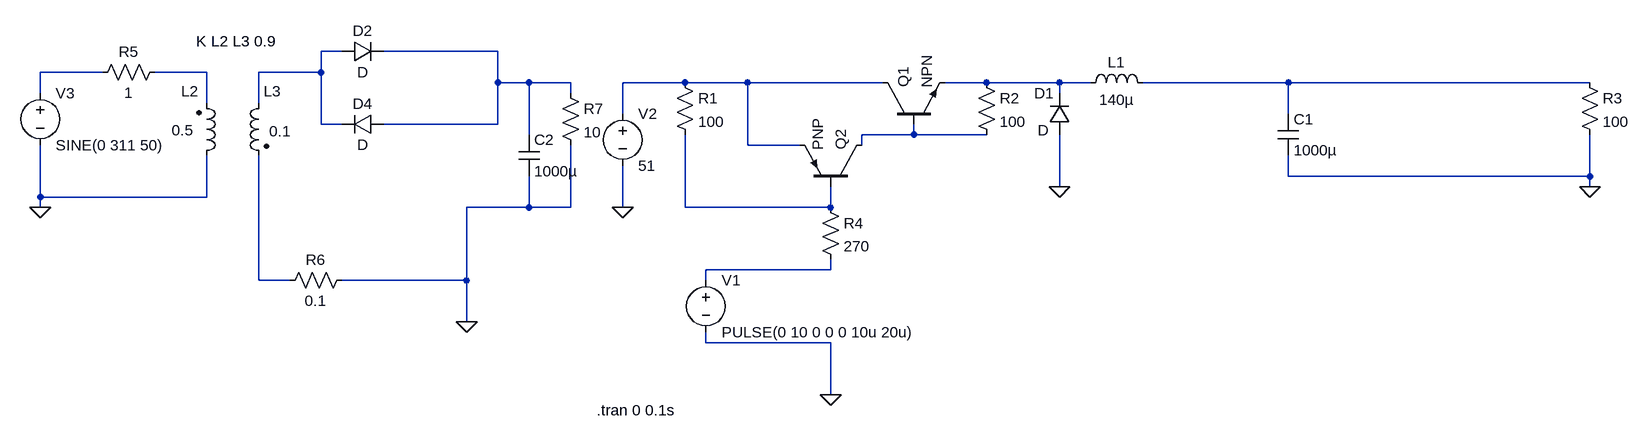
[diagram p0: schematic Fuente conmutada - prototipo 1.asc]
Fuente conmutada - prototipo 1.asc, the LTspice schematic file:
Version 4
SHEET 1 1476 880
WIRE -512 48 -544 48
WIRE -272 48 -448 48
WIRE -880 80 -976 80
WIRE -720 80 -800 80
WIRE -544 80 -544 48
WIRE -544 80 -640 80
WIRE -272 96 -272 48
WIRE -224 96 -272 96
WIRE -160 96 -224 96
WIRE 16 96 -80 96
WIRE 112 96 16 96
WIRE 320 96 112 96
WIRE 480 96 416 96
WIRE 592 96 480 96
WIRE 640 96 592 96
WIRE 944 96 720 96
WIRE 1408 96 944 96
WIRE -976 112 -976 80
WIRE -160 112 -160 96
WIRE 592 112 592 96
WIRE -720 128 -720 80
WIRE -640 128 -640 80
WIRE -80 144 -80 96
WIRE 944 144 944 96
WIRE -544 160 -544 80
WIRE -512 160 -544 160
WIRE -272 160 -272 96
WIRE -272 160 -448 160
WIRE -224 176 -224 96
WIRE 368 176 368 160
WIRE 368 176 288 176
WIRE 480 176 368 176
WIRE 112 192 112 96
WIRE 192 192 112 192
WIRE 288 192 288 176
WIRE 944 240 944 208
WIRE 1408 240 1408 176
WIRE 1408 240 944 240
WIRE 592 256 592 176
WIRE 1408 256 1408 240
WIRE -976 272 -976 192
WIRE -720 272 -720 208
WIRE -720 272 -976 272
WIRE -976 288 -976 272
WIRE -224 288 -224 240
WIRE -224 288 -320 288
WIRE -160 288 -160 192
WIRE -160 288 -224 288
WIRE -80 288 -80 224
WIRE 16 288 16 176
WIRE 240 288 240 256
WIRE 240 288 16 288
WIRE 240 384 240 368
WIRE 240 384 48 384
WIRE -640 400 -640 208
WIRE -592 400 -640 400
WIRE -320 400 -320 288
WIRE -320 400 -512 400
WIRE 48 400 48 384
WIRE -320 464 -320 400
WIRE 48 496 48 480
WIRE 240 496 48 496
WIRE 240 576 240 496
FLAG 240 576 0
FLAG 592 256 0
FLAG 1408 256 0
FLAG -976 288 0
FLAG -320 464 0
FLAG -80 288 0
SYMBOL res 0 80 R0
SYMATTR InstName R1
SYMATTR Value 100
SYMBOL npn 320 160 R270
SYMATTR InstName Q1
SYMBOL pnp 288 256 M270
SYMATTR InstName Q2
SYMBOL res 464 80 R0
SYMATTR InstName R2
SYMATTR Value 100
SYMBOL diode 608 176 R180
WINDOW 0 24 64 Left 2
WINDOW 3 32 7 Left 2
SYMATTR InstName D1
SYMBOL ind 624 112 R270
WINDOW 0 32 56 VTop 2
WINDOW 3 5 56 VBottom 2
SYMATTR InstName L1
SYMATTR Value 140µ
SYMBOL res 1392 80 R0
SYMATTR InstName R3
SYMATTR Value 100
SYMBOL voltage 48 384 R0
WINDOW 123 0 0 Left 2
WINDOW 39 0 0 Left 2
SYMATTR InstName V1
SYMATTR Value PULSE(0 10 0 0 0 10u 20u)
SYMBOL res 224 272 R0
SYMATTR InstName R4
SYMATTR Value 270
SYMBOL voltage -976 96 R0
WINDOW 123 0 0 Left 2
WINDOW 39 0 0 Left 2
SYMATTR InstName V3
SYMATTR Value SINE(0 311 50)
SYMBOL ind2 -736 224 M180
WINDOW 0 -23 115 Left 2
WINDOW 3 -38 55 Left 2
SYMATTR InstName L2
SYMATTR Value 0.5
SYMBOL ind2 -624 112 M0
WINDOW 0 -19 -3 Left 2
WINDOW 3 -34 59 Left 2
SYMATTR InstName L3
SYMATTR Value 0.1
SYMBOL diode -512 64 R270
WINDOW 0 32 32 VTop 2
WINDOW 3 0 32 VBottom 2
SYMATTR InstName D2
SYMBOL diode -448 144 R90
WINDOW 0 0 32 VBottom 2
WINDOW 3 32 32 VTop 2
SYMATTR InstName D4
SYMBOL res -496 384 R90
WINDOW 0 0 56 VBottom 2
WINDOW 3 32 56 VTop 2
SYMATTR InstName R6
SYMATTR Value 0.1
SYMBOL res -784 64 R90
WINDOW 0 0 56 VBottom 2
WINDOW 3 32 56 VTop 2
SYMATTR InstName R5
SYMATTR Value 1
SYMBOL voltage -80 128 R0
SYMATTR InstName V2
SYMATTR Value 51
SYMBOL cap 928 144 R0
SYMATTR InstName C1
SYMATTR Value 1000µ
SYMBOL cap -240 176 R0
SYMATTR InstName C2
SYMATTR Value 1000µ
SYMBOL res -176 96 R0
SYMATTR InstName R7
SYMATTR Value 10
TEXT -120 600 Left 2 !.tran 0 0.1s
TEXT -736 32 Left 2 !K L2 L3 0.9

The netlist it stands for:
* Fuente conmutada - prototipo 1.asc
R1 N005 N009 100
Q1 N005 N008 N006 0 NPN
Q2 N008 N009 N005 0 PNP
R2 N006 N008 100
D1 0 N006 D
L1 N006 N007 140µ
R3 N007 0 100
V1 N010 0 PULSE(0 10 0 0 0 10u 20u)
R4 N009 N010 270
V3 N003 0 SINE(0 311 50)
L2 0 N004 0.5
L3 N001 N011 0.1
D2 N001 N002 D
D4 N002 N001 D
R6 0 N011 0.1
R5 N004 N003 1
V2 N005 0 51
C1 N007 0 1000µ
C2 N002 0 1000µ
R7 N002 0 10
.model D D
.lib standard.dio
.model NPN NPN
.model PNP PNP
.lib standard.bjt
.tran 0 0.1s
K L2 L3 0.9
.backanno
.end